# Altium schematic sheet toch_cap.SchDoc
size A4
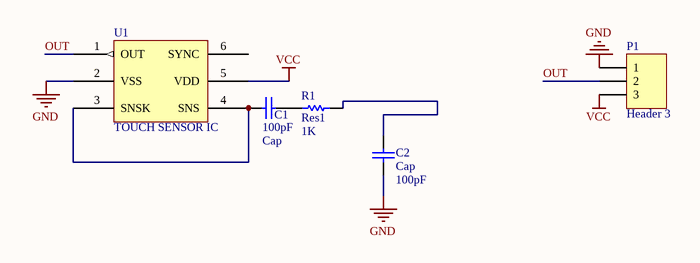
[diagram p0: toch_cap.SchDoc]

## Parts
C1  Cap  value 100pF  [0805E]
C2  Cap  value 100pF  [0805E]
P1  Header 3  [HDR1X3]
R1  Res1  value 1K  [0805E]
U1  TOUCH SENSOR IC  [SOT23-6_L]

## Nets
GND: C2.1 P1.1 U1.2(VSS)
VCC: P1.3 U1.5(VDD)
OUT: P1.2 U1.1(OUT)
NetC1_1: C1.1 U1.3(SNSK) U1.4(SNS)
NetC1_2: C1.2 R1.1
NetC2_2: C2.2 R1.2

Not connected (* = marked no-connect by the designer): U1 6(SYNC)

## Library data of the parts
C1 C2 = Cap: Capacitor; Published: 8-Jun-2000; LatestRevisionDate: 17-Jul-2002; LatestRevisionNote: Re-released for DXP Platform.; PackageReference: RAD-0.3; Publisher: Altium Limited; PackageDescription: Radial Cap, Thru-Hole; 2 Leads; 0.3 in Pin Spacing
P1 = Header 3: Header, 3-Pin; LatestRevisionDate: 17-Jul-2002; LatestRevisionNote: Re-released for DXP Platform.; Publisher: Altium Limited
R1 = Res1: Resistor; Published: 8-Jun-2000; LatestRevisionDate: 17-Jul-2002; LatestRevisionNote: Re-released for DXP Platform.; PackageReference: AXIAL-0.3; Publisher: Altium Limited; PackageDescription: Axial Device, Thru-Hole; 2 Leads; 0.3 in Pin Spacing
U1 = AT42QT1011